# Altium schematic sheet WiFi&4G_F2.SchDoc
size A4
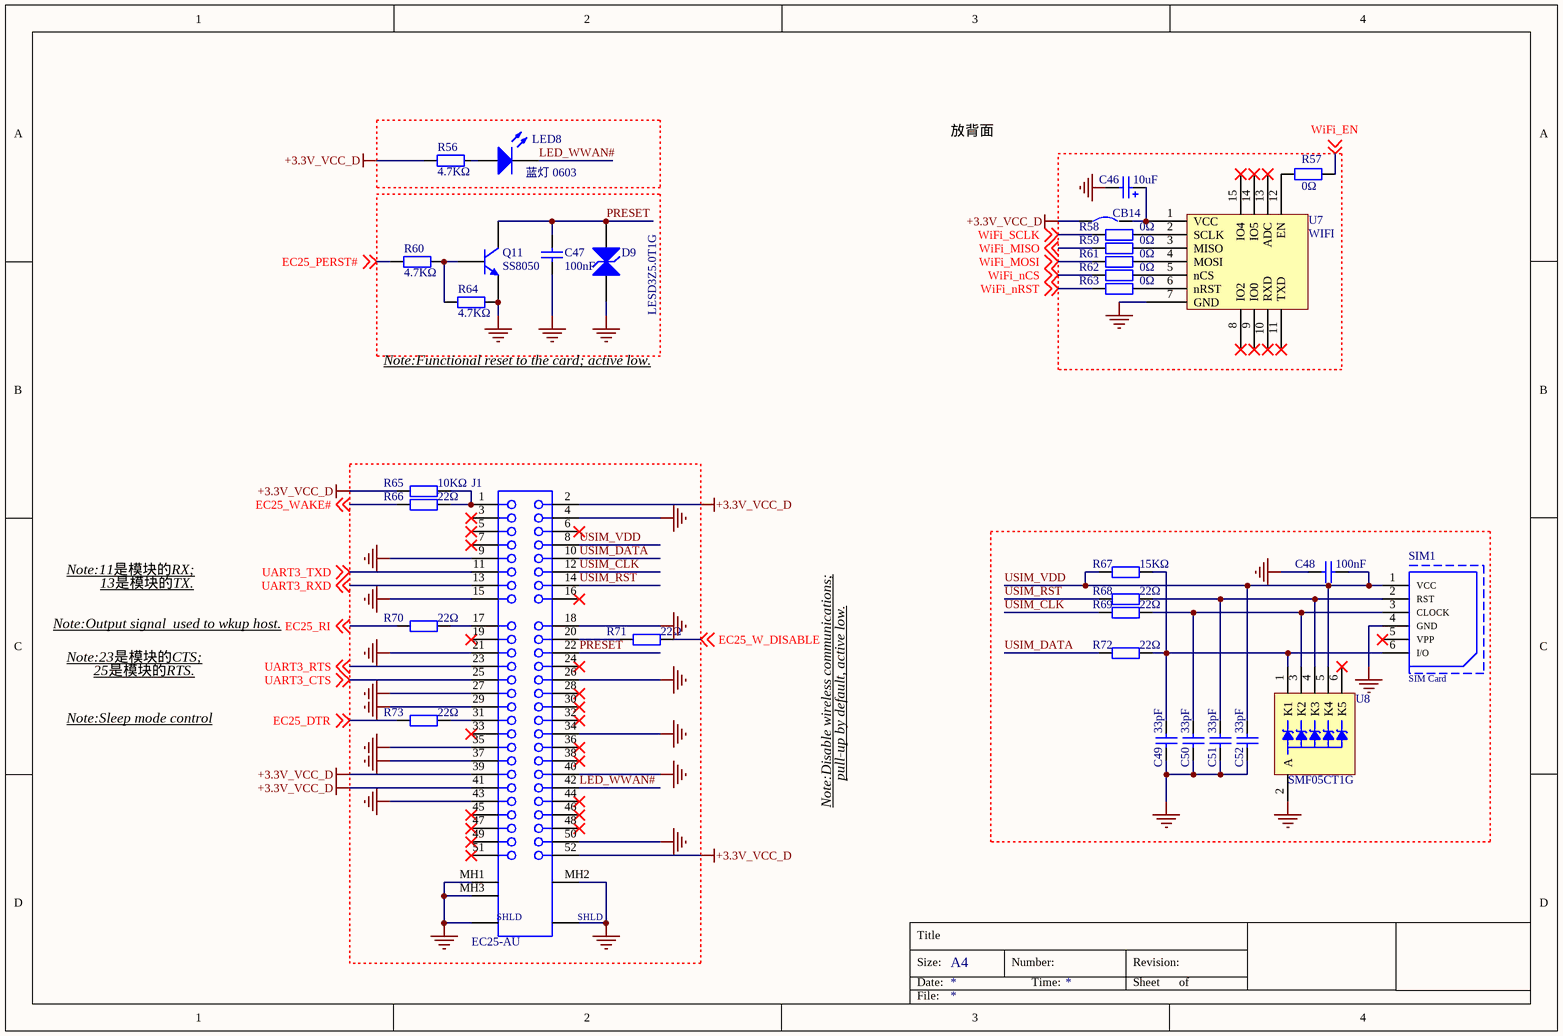
[diagram p0: WiFi&4G_F2.SchDoc]

## Parts
C46  10uF  [CASE-A_3216]
C47  100nF  [0603_C]
C48  100nF  [0402_C]
C49  33pF  [0402_C]
C50  33pF  [0402_C]
C51  33pF  [0402_C]
C52  33pF  [0402_C]
CB14  CB  [CW]  (value not drawn)  (no BOM)
D9  LESD3Z5.0T1G  [SOD-323]
J1  EC25-AU  [PCIEmin-i]
LED8  蓝灯 0603  [0603_LED_S1]
Q11  SS8050  [SOT-23(SOT-23-3)]
R56  4.7KΩ  [0603_R]
R57  0Ω  [0402_R]
R58  0Ω  [0402_R]
R59  0Ω  [0402_R]
R60  4.7KΩ  [0603_R]
R61  0Ω  [0402_R]
R62  0Ω  [0402_R]
R63  0Ω  [0402_R]
R64  4.7KΩ  [0603_R]
R65  10KΩ  [0402_R]
R66  22Ω  [0402_R]
R67  15KΩ  [0402_R]
R68  22Ω  [0402_R]
R69  22Ω  [0402_R]
R70  22Ω  [0402_R]
R71  22Ω  [0402_R]
R72  22Ω  [0402_R]
R73  22Ω  [0402_R]
SIM1  SIM Card  [SIM Card]
U7  WIFI  [MT8266WIFI-H]
U8  SMF05CT1G  [SC-70-6(SOT-363)]

## Nets
+3.3V_VCC_D: CB14.1 J1.2 J1.39 J1.41 J1.52 R56.2 R65.1
GND: C46.2 C47.1 C48.1 C49.1 C50.1 C51.1 C52.1 D9.1(A) J1.4 J1.9 J1.15 J1.18 J1.21 J1.26 J1.27 J1.29 J1.34 J1.35 J1.37 J1.40 J1.43 J1.50 J1.53(SHLD) J1.54(SHLD) J1.MH1 J1.MH2 J1.MH3 Q11.2(E) R64.2 SIM1.4(GND) U7.7(GND) U8.2(A)
EC25_DTR: R73.1 ; off-sheet EC25_DTR
EC25_PERST#: R60.1 ; off-sheet EC25_PERST#
EC25_RI: R70.1 ; off-sheet EC25_RI
EC25_W_DISABLE: R71.2 ; off-sheet EC25_W_DISABLE
EC25_WAKE#: R66.1 ; off-sheet EC25_WAKE#
LED_WWAN#: J1.42 LED8.K
PRESET: C47.2 D9.2(K) J1.22 Q11.3(C)
UART3_CTS: J1.25 ; off-sheet UART3_CTS
UART3_RTS: J1.23 ; off-sheet UART3_RTS
UART3_RXD: J1.13 ; off-sheet UART3_RXD
UART3_TXD: J1.11 ; off-sheet UART3_TXD
USIM_CLK: J1.12 R69.1
USIM_DATA: J1.10 R72.1
USIM_RST: J1.14 R68.1
USIM_VDD: C48.2 C52.2 J1.8 R67.2 SIM1.1(VCC) U8.5(K4)
WiFi_EN: R57.2 ; off-sheet WiFi_EN
WiFi_MISO: R59.1 ; off-sheet WiFi_MISO
WiFi_MOSI: R61.1 ; off-sheet WiFi_MOSI
WiFi_nCS: R62.1 ; off-sheet WiFi_nCS
WiFi_nRST: R63.1 ; off-sheet WiFi_nRST
WiFi_SCLK: R58.1 ; off-sheet WiFi_SCLK
NetC46_1: C46.1 CB14.2 U7.1(VCC)
NetC49_2: C49.2 R67.1 R72.2 SIM1.6(I/O) U8.1(K1)
NetC50_2: C50.2 R69.2 SIM1.3(CLOCK) U8.3(K2)
NetC51_2: C51.2 R68.2 SIM1.2(RST) U8.4(K3)
NetJ1_1: J1.1 R65.2 R66.2
NetJ1_17: J1.17 R70.2
NetJ1_20: J1.20 R71.1
NetJ1_31: J1.31 R73.2
NetLED8_A: LED8.A R56.1
NetQ11_1: Q11.1(B) R60.2 R64.1
NetR57_1: R57.1 U7.12(EN)
NetR58_2: R58.2 U7.2(SCLK)
NetR59_2: R59.2 U7.3(MISO)
NetR61_2: R61.2 U7.4(MOSI)
NetR62_2: R62.2 U7.5(nCS)
NetR63_2: R63.2 U7.6(nRST)

Not connected (* = marked no-connect by the designer): J1 3* 5* 6* 7* 16* 19* 24* 28* 30* 32* 33* 36* 38* 44* 45* 46* 47* 48* 49* 51*; SIM1 5(VPP)*; U7 8(IO2)* 9(IO0)* 10(RXD)* 11(TXD)* 13(ADC)* 14(IO5)* 15(IO4)*; U8 6(K5)*

## Notes on the sheet
- 放背面
- Note:Functional reset to the card; active low.
- Note:11是模块的RX;
- Note:Output signal  used to wkup host.
- 13是模块的TX.
- Note:23是模块的CTS;
- 25是模块的RTS.
- Note:Sleep mode control
- pull-up by default, active low.
- Note:Disable wireless communications;
- Title
- Size:
- Date:
- A4
- Number:
- Time:
- Revision:
- Sheet
- of
- File:
- *

## Library data of the parts
C46 = Cap 3216 10uF (106) 10% 16V: 钽电容; ComponentLink1Description: 供应商链接; ComponentLink1URL: http://www.szlcsc.com/product/details_7643.html; Package: 3216; Supplier: LC; SuppliersPartNumber: C7171
C47 = Cap 0603 100nF (104) 10% 50V: 贴片电容; ComponentLink1Description: 供应商链接; ComponentLink1URL: http://www.szlcsc.com/product/details_15331.html; Package: 0603; Supplier: LC; SuppliersPartNumber: C14663
C48 = Cap 0402 100nF (104) 10% 16V: 贴片电容; ComponentLink1Description: 供应商链接; ComponentLink1URL: http://www.szlcsc.com/product/details_1877.html; Package: 0402; Supplier: LC; SuppliersPartNumber: C1525
C49-C52 = Cap 0402 33pF (330) 5% 50V: 贴片电容; ComponentLink1Description: 供应商链接; ComponentLink1URL: http://www.szlcsc.com/product/details_1914.html; Package: 0402; Supplier: LC; SuppliersPartNumber: C1562
CB14 = Circuit Breaker: Published: 24-Mar-1999; LatestRevisionDate: 17-Jul-2002; LatestRevisionNote: Re-released for DXP Platform.; PackageReference: SPST-2; Publisher: Altium Limited
D9 = SOD-323 LESD3Z5.0T1G: TVS/ESD, SOD-323, 5V; ComponentLink1Description: 供应商链接; ComponentLink1URL: http://www.szlcsc.com/product/details_79530.html; Package: SMB/DO-214AA; Supplier: LC; SuppliersPartNumber: C78395
J1 = PCIE-Mini: Female Header, Pitch 0.8 mm, 2 x 26 Position, Height 9.9 mm, -40 to 85 degC, RoHS, Tape and Reel, CMP-2000-05614-1, 48338-0099; Brand: Molex; Number of Positions / Contacts: 52; Mounting Angle: Right; Housing Material: Thermoplastic; Mounting Style: SMD/SMT; Series: 48338; Contact Plating: Gold; Product Category: PCIExpress/PCIConnectors; Factory Pack Quantity: 300; Manufacturer: Molex; Package Description: 52-Pin Surface Mount Device, Body 30 x 9.3 mm, Pitch 0.8 mm; Datasheet Version: Rev. F, 06/2009; Mounting Technology: SurfaceMount; Packaging: Reel; Product Type: MiniPCI; Package Reference: 48338-0099; Manufacturer URL: http://www.molex.com/; Contact Material: CopperAlloy; Datasheet URL: http://www.molex.com/pdm_docs/sd/483380099_sd.pdf; Number of Positions: 52; RoHS: Details
LED8 = LED 0603 蓝灯: 发光二极管; ComponentLink1Description: 供应商链接; ComponentLink1URL: http://www.szlcsc.com/product/details_73150.html; Package: 0603; Supplier: LC; SuppliersPartNumber: C72041
Q11 = NPN SOT-23 SS8050 Y1: NPN 三极管; ComponentLink1Description: 供应商链接; ComponentLink1URL: http://www.szlcsc.com/product/details_2507.html; Package: SOT-23; Supplier: LC; SuppliersPartNumber: C2150
R56 R60 R64 = Res 0603 4.7KΩ (4701) 1%: 贴片电阻; ComponentLink1Description: 供应商链接; ComponentLink1URL: http://www.szlcsc.com/product/details_23889.html; Package: 0603; Supplier: LC; SuppliersPartNumber: C23162
R57-R59 R61-R63 = Res 0402 0Ω (0R0) 1%: 贴片电阻; ComponentLink1Description: 供应商链接; ComponentLink1URL: http://www.szlcsc.com/product/details_17853.html; Package: 0402; Supplier: LC; SuppliersPartNumber: C17168; Value: 0Ω
R65 = Res 0402 10KΩ (1002) 1%: 贴片电阻; ComponentLink1Description: 供应商链接; ComponentLink1URL: http://www.szlcsc.com/product/details_26487.html; Package: 0402; Supplier: LC; SuppliersPartNumber: C25744; Value: 10KΩ
R66 R68-R73 = Res 0402 22Ω (22R0) 1%: 贴片电阻; ComponentLink1Description: 供应商链接; ComponentLink1URL: http://www.szlcsc.com/product/details_25835.html; Package: 0402; Supplier: LC; SuppliersPartNumber: C25092; Value: 22Ω
R67 = Res 0402 15KΩ (1502) 1%: 贴片电阻; ComponentLink1Description: 供应商链接; ComponentLink1URL: http://www.szlcsc.com/product/details_26499.html; Package: 0402; Supplier: LC; SuppliersPartNumber: C25756
SIM1 = SIM Card MUP: MUP, 6P; Manufacturer: Wurth Elektronik; Part Number: 693010020611; Working Voltage: 50VAC; Rated Current: 0.5A; Withstanding Voltage: 500VAC; Packaging: TapeandReel; Manufacturer URL: http://www.we-online.de; Operating Temperature: -25to85degC; Publisher: WurthElektronik; Package Reference: 693010020611; Datasheet URL: https://katalog.we-online.de/em/datasheet/693010020611.pdf; Mounting Technology: SMT; Taobao: https://item.taobao.com/item.htm?spm=a230r.1.14.37.7dfabe7eHV2uMn&id=550214241835&ns=1&abbucket=6#detail
U7 = MT8266WIFI
U8 = SMF05CT1G_[C15879]_i: TVS; ComponentLink1Description: 供应商链接; ComponentLink1URL: http://www.szlcsc.com/product/details_16561.html; Package: SC-70-6(SOT-363); Supplier: LC; SuppliersPartNumber: C15879